# Altium schematic sheet SystemMemory.SchDoc: =ProjectTitle
size B; Engineer: H. Collector; Organization: IMR Engineering; Address1: 3621 Gin Way; Address2: Snellville, GA 30039; Address3: USA; SheetNumber: 4; SheetTotal: 10
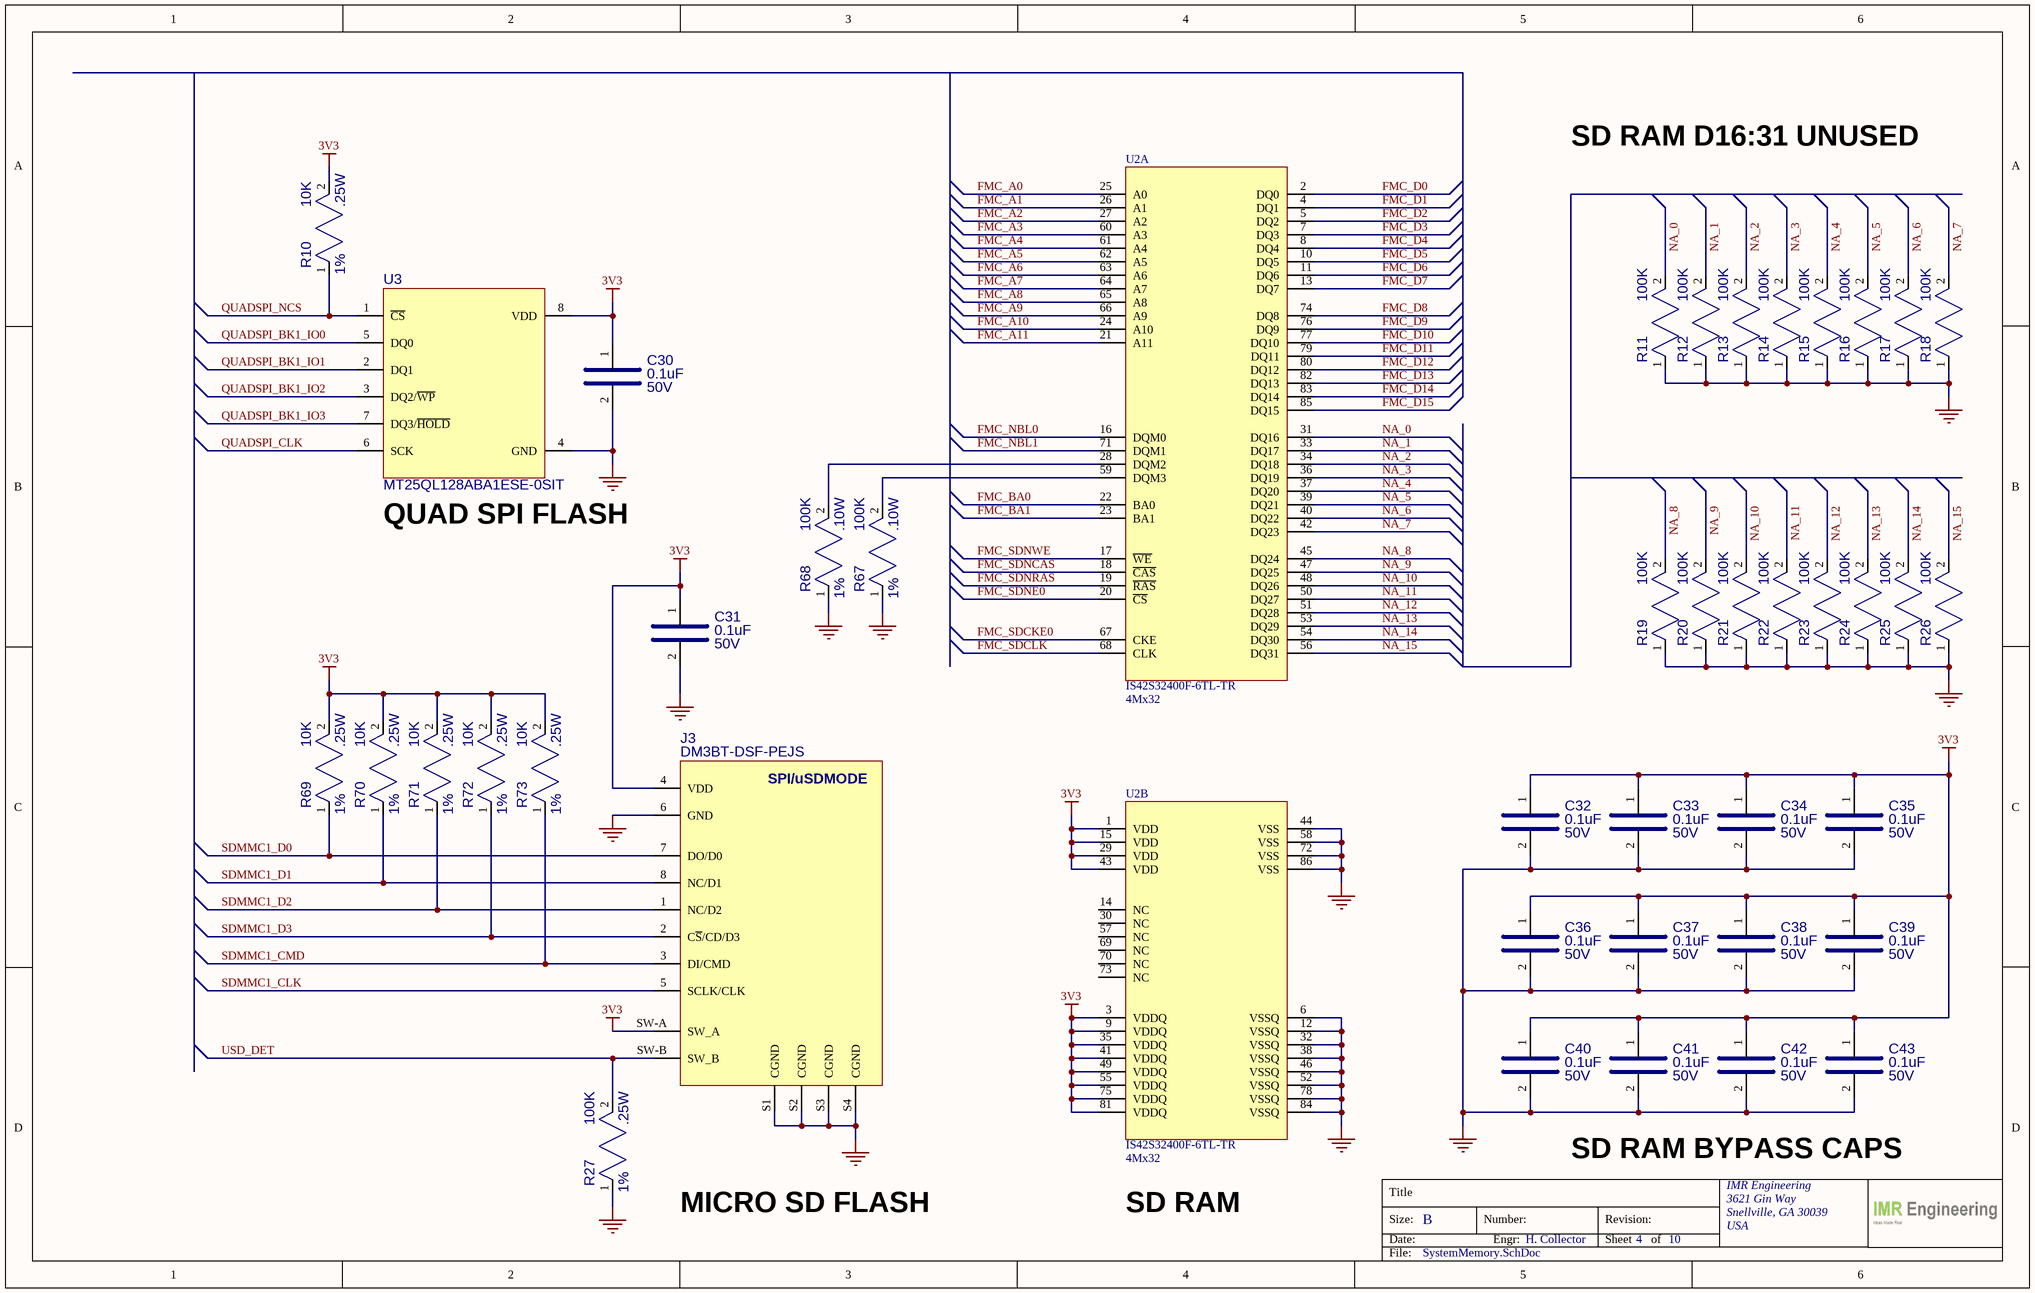
[diagram p0: SystemMemory.SchDoc]

## Parts
C30  value 0.1uF  VOLTAGE: 50V  [CAP_0805]  (hidden comment: 08055C104KAT2A)
C31  value 0.1uF  VOLTAGE: 50V  [CAP_0805]  (hidden comment: 08055C104KAT2A)
C32  value 0.1uF  VOLTAGE: 50V  [CAP_0603]  (hidden comment: CC0603KRX7R9BB104)
C33  value 0.1uF  VOLTAGE: 50V  [CAP_0603]  (hidden comment: CC0603KRX7R9BB104)
C34  value 0.1uF  VOLTAGE: 50V  [CAP_0603]  (hidden comment: CC0603KRX7R9BB104)
C35  value 0.1uF  VOLTAGE: 50V  [CAP_0603]  (hidden comment: CC0603KRX7R9BB104)
C36  value 0.1uF  VOLTAGE: 50V  [CAP_0603]  (hidden comment: CC0603KRX7R9BB104)
C37  value 0.1uF  VOLTAGE: 50V  [CAP_0603]  (hidden comment: CC0603KRX7R9BB104)
C38  value 0.1uF  VOLTAGE: 50V  [CAP_0603]  (hidden comment: CC0603KRX7R9BB104)
C39  value 0.1uF  VOLTAGE: 50V  [CAP_0603]  (hidden comment: CC0603KRX7R9BB104)
C40  value 0.1uF  VOLTAGE: 50V  [CAP_0603]  (hidden comment: CC0603KRX7R9BB104)
C41  value 0.1uF  VOLTAGE: 50V  [CAP_0603]  (hidden comment: CC0603KRX7R9BB104)
C42  value 0.1uF  VOLTAGE: 50V  [CAP_0603]  (hidden comment: CC0603KRX7R9BB104)
C43  value 0.1uF  VOLTAGE: 50V  [CAP_0603]  (hidden comment: CC0603KRX7R9BB104)
J3  DM3BT-DSF-PEJS  [HRS_DM3BT-DSF-PEJS]
R10  value 10K  TOLERANCE: 1%  POWER: .25W  [RES_0805]  (hidden comment: SG73S2ATTD1002F)
R11  value 100K  [RES_0603]  (hidden comment: RC0603FR-07100KL)
R12  value 100K  [RES_0603]  (hidden comment: RC0603FR-07100KL)
R13  value 100K  [RES_0603]  (hidden comment: RC0603FR-07100KL)
R14  value 100K  [RES_0603]  (hidden comment: RC0603FR-07100KL)
R15  value 100K  [RES_0603]  (hidden comment: RC0603FR-07100KL)
R16  value 100K  [RES_0603]  (hidden comment: RC0603FR-07100KL)
R17  value 100K  [RES_0603]  (hidden comment: RC0603FR-07100KL)
R18  value 100K  [RES_0603]  (hidden comment: RC0603FR-07100KL)
R19  value 100K  [RES_0603]  (hidden comment: RC0603FR-07100KL)
R20  value 100K  [RES_0603]  (hidden comment: RC0603FR-07100KL)
R21  value 100K  [RES_0603]  (hidden comment: RC0603FR-07100KL)
R22  value 100K  [RES_0603]  (hidden comment: RC0603FR-07100KL)
R23  value 100K  [RES_0603]  (hidden comment: RC0603FR-07100KL)
R24  value 100K  [RES_0603]  (hidden comment: RC0603FR-07100KL)
R25  value 100K  [RES_0603]  (hidden comment: RC0603FR-07100KL)
R26  value 100K  [RES_0603]  (hidden comment: RC0603FR-07100KL)
R27  value 100K  TOLERANCE: 1%  POWER: .25W  [PMG_RES_0805]  (hidden comment: RK73H2ATTD1003F)
R67  value 100K  TOLERANCE: 1%  POWER: .10W  [RES_0603]  (hidden comment: RC0603FR-07100KL)
R68  value 100K  TOLERANCE: 1%  POWER: .10W  [RES_0603]  (hidden comment: RC0603FR-07100KL)
R69  value 10K  TOLERANCE: 1%  POWER: .25W  [RES_0805]  (hidden comment: SG73S2ATTD1002F)
R70  value 10K  TOLERANCE: 1%  POWER: .25W  [RES_0805]  (hidden comment: SG73S2ATTD1002F)
R71  value 10K  TOLERANCE: 1%  POWER: .25W  [RES_0805]  (hidden comment: SG73S2ATTD1002F)
R72  value 10K  TOLERANCE: 1%  POWER: .25W  [RES_0805]  (hidden comment: SG73S2ATTD1002F)
R73  value 10K  TOLERANCE: 1%  POWER: .25W  [RES_0805]  (hidden comment: SG73S2ATTD1002F)
U2  IS42S32400F-6TL-TR  value 4Mx32  [86TSOPII]  (parts A,B of 2)
U3  MT25QL128ABA1ESE-0SIT  [SO8W]

## Nets
3V3: C30.1 C31.1 C32.1 C33.1 C34.1 C35.1 C36.1 C37.1 C38.1 C39.1 C40.1 C41.1 C42.1 C43.1 J3.4(VDD) J3.SW-A(SW_A) R10.2 R69.2 R70.2 R71.2 R72.2 R73.2 U2.1(VDD) U2.3(VDDQ) U2.9(VDDQ) U2.15(VDD) U2.29(VDD) U2.35(VDDQ) U2.41(VDDQ) U2.43(VDD) U2.49(VDDQ) U2.55(VDDQ) U2.75(VDDQ) U2.81(VDDQ) U3.8(VDD)
GND: C30.2 C31.2 C32.2 C33.2 C34.2 C35.2 C36.2 C37.2 C38.2 C39.2 C40.2 C41.2 C42.2 C43.2 J3.6(GND) J3.S1(CGND) J3.S2(CGND) J3.S3(CGND) J3.S4(CGND) R11.1 R12.1 R13.1 R14.1 R15.1 R16.1 R17.1 R18.1 R19.1 R20.1 R21.1 R22.1 R23.1 R24.1 R25.1 R26.1 R27.1 R67.1 R68.1 U2.6(VSSQ) U2.12(VSSQ) U2.32(VSSQ) U2.38(VSSQ) U2.44(VSS) U2.46(VSSQ) U2.52(VSSQ) U2.58(VSS) U2.72(VSS) U2.78(VSSQ) U2.84(VSSQ) U2.86(VSS) U3.4(GND)
FMC_A0: U2.25(A0)
FMC_A1: U2.26(A1)
FMC_A2: U2.27(A2)
FMC_A3: U2.60(A3)
FMC_A4: U2.61(A4)
FMC_A5: U2.62(A5)
FMC_A6: U2.63(A6)
FMC_A7: U2.64(A7)
FMC_A8: U2.65(A8)
FMC_A9: U2.66(A9)
FMC_A10: U2.24(A10)
FMC_A11: U2.21(A11)
FMC_BA0: U2.22(BA0)
FMC_BA1: U2.23(BA1)
FMC_D0: U2.2(DQ0)
FMC_D1: U2.4(DQ1)
FMC_D2: U2.5(DQ2)
FMC_D3: U2.7(DQ3)
FMC_D4: U2.8(DQ4)
FMC_D5: U2.10(DQ5)
FMC_D6: U2.11(DQ6)
FMC_D7: U2.13(DQ7)
FMC_D8: U2.74(DQ8)
FMC_D9: U2.76(DQ9)
FMC_D10: U2.77(DQ10)
FMC_D11: U2.79(DQ11)
FMC_D12: U2.80(DQ12)
FMC_D13: U2.82(DQ13)
FMC_D14: U2.83(DQ14)
FMC_D15: U2.85(DQ15)
FMC_NBL0: U2.16(DQM0)
FMC_NBL1: U2.71(DQM1)
FMC_SDCKE0: U2.67(CKE)
FMC_SDCLK: U2.68(CLK)
FMC_SDNCAS: U2.18(~{CAS})
FMC_SDNE0: U2.20(~{CS})
FMC_SDNRAS: U2.19(~{RAS})
FMC_SDNWE: U2.17(~{WE})
NA_0: R11.2 U2.31(DQ16)
NA_1: R12.2 U2.33(DQ17)
NA_2: R13.2 U2.34(DQ18)
NA_3: R14.2 U2.36(DQ19)
NA_4: R15.2 U2.37(DQ20)
NA_5: R16.2 U2.39(DQ21)
NA_6: R17.2 U2.40(DQ22)
NA_7: R18.2 U2.42(DQ23)
NA_8: R19.2 U2.45(DQ24)
NA_9: R20.2 U2.47(DQ25)
NA_10: R21.2 U2.48(DQ26)
NA_11: R22.2 U2.50(DQ27)
NA_12: R23.2 U2.51(DQ28)
NA_13: R24.2 U2.53(DQ29)
NA_14: R25.2 U2.54(DQ30)
NA_15: R26.2 U2.56(DQ31)
QUADSPI_BK1_IO0: U3.5(DQ0)
QUADSPI_BK1_IO1: U3.2(DQ1)
QUADSPI_BK1_IO2: U3.3(DQ2/~{WP})
QUADSPI_BK1_IO3: U3.7(DQ3/~{HOLD})
QUADSPI_CLK: U3.6(SCK)
QUADSPI_NCS: R10.1 U3.1(~{CS})
SDMMC1_CLK: J3.5(SCLK/CLK)
SDMMC1_CMD: J3.3(DI/CMD) R73.1
SDMMC1_D0: J3.7(DO/D0) R69.1
SDMMC1_D1: J3.8(NC/D1) R70.1
SDMMC1_D2: J3.1(NC/D2) R71.1
SDMMC1_D3: J3.2(C~{S}/CD/D3) R72.1
USD_DET: J3.SW-B(SW_B) R27.2
NetR67_2: R67.2 U2.59(DQM3)
NetR68_2: R68.2 U2.28(DQM2)

Not connected (* = marked no-connect by the designer): U2 14(NC) 30(NC) 57(NC) 69(NC) 70(NC) 73(NC)

## Notes on the sheet
- SD RAM D16:31 UNUSED
- (near U3) QUAD SPI FLASH
- SD RAM BYPASS CAPS
- MICRO SD FLASH
- SD RAM
- Title
- Size:
- Date:
- B
- Number:
- Engr:
- Revision:
- Sheet
- of
- File:
- (in symbol CONN_HIROSE_DM3BT-DSF-PEJS) SPI/uSDMODE

## Library data of the parts
C30 C31 = CAP_0.1UF_50V_0805: CAP CER 0.1UF 50V X7R 0805; MFG: AVX; TOLERANCE: 10%; MFG_PN: 08055C104KAT2A; Supplier 1: Digi-Key; Supplier Part Number 1: 478-1395-1-ND; Case/Package: 0805
  C30: ClassName: Memory_Quad_SPI_Flash
  C31: ClassName: Memory_MicroSD
C32-C43 = CAP_0.1UF_50V_0603: CAP CER 0.1UF 50V X7R 0603; MFG: Yageo; TOLERANCE: 10%; MFG_PN: CC0603KRX7R9BB104; Supplier 1: Digi-Key; Supplier Part Number 1: 311-1344-1-ND; Case/Package: 0603; ClassName: Memory_SDRAM
J3 = CONN_HIROSE_DM3BT-DSF-PEJS: CONN MICRO SD CARD PUSH-PUSH R/A; MFG: Hirose Electric Co Ltd; MFG_PN: DM3BT-DSF-PEJS; Supplier 1: Digi-Key; Supplier Part Number 1: HR1942CT-ND; VALUE: DM3BT-DSF-PEJS; ClassName: Memory_MicroSD
R10 R69-R73 = RES_10K_0805_1/4W_1%: RES SMD 10K OHM 1% 1/4W 0805; MFG: KOA Speer Electronics, Inc.; Case/Package: 0805; MFG_PN: SG73S2ATTD1002F; Supplier 1: Digi-Key; Supplier Part Number 1: 2019-SG73S2ATTD1002FCT-ND
  R69-R73: ClassName: Memory_MicroSD
R11-R26 = RES_100K_0603_1/10W_1%: RES SMD 100K OHM 1% 1/10W 0603; MFG: Yageo; POWER: .10W; Case/Package: 0603; MFG_PN: RC0603FR-07100KL; Supplier 1: Digi-Key; Supplier Part Number 1: 311-100KHRCT-ND; TOLERANCE: 1%
R27 = RES_100K_0805_1/4W_1%: RES SMD 100K OHM 1% 1/4W 0805; MFG: KOA Speer Electronics, Inc.; Case/Package: 0805; MFG_PN: RK73H2ATTD1003F; Supplier 1: Digi-Key; Supplier Part Number 1: 2019-RK73H2ATTD1003FCT-ND; ClassName: Memory_MicroSD
R67 R68 = RES_100K_0603_1/10W_1%: RES SMD 100K OHM 1% 1/10W 0603; MFG: Yageo; Case/Package: 0603; MFG_PN: RC0603FR-07100KL; Supplier 1: Digi-Key; Supplier Part Number 1: 311-100KHRCT-ND
U2 = IC_ IS42S32400F-6TL: IC DRAM 128M PARALLEL 86TSOP II; MFG: ISSI, Integrated Silicon Solution Inc; MFG_PN: IS42S32400F-6TL-TR; Supplier 1: Mouser; Supplier Part Number 1: 870-IS42S32400F-6TL; Case/Package: 86TSSOPII; ClassName: Memory_SDRAM
U3 = IC_MT25QL128ABA1ESE-0SIT: IC FLASH 128M SPI 133MHZ 8SOP2; MFG: Micron Technology Inc.; MFG_PN: MT25QL128ABA1ESE-0SIT; Supplier 1: Digi-Key; Supplier Part Number 1: 557-1772-1-ND; Case/Package: 8SOP2; VALUE: MT25QL128ABA1ESE-0SIT; ClassName: Memory_Quad_SPI_Flash